# EAGLE schematic Rotall Encoder ver1.0 (EAGLE 9.6.2)
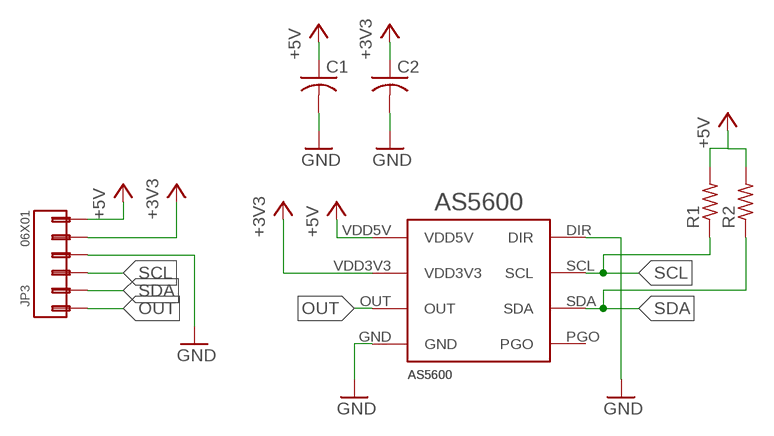
[diagram p0: schematic, sheet 1]

## Parts
C1  C-USC0603  [C0603]
C2  C-USC0603  [C0603]
JP3  06X01  [06X01]
R1  R-US_R0603  [R0603]
R2  R-US_R0603  [R0603]
U1  AS5600  [AS5600]

## Nets
+3V3: C2.1 JP3.2 U1.VDD3V3
+5V: C1.1 JP3.1 R1.2 R2.2 U1.VDD5V
GND: C1.2 C2.2 JP3.3 U1.DIR U1.GND
OUT: JP3.6 U1.OUT
SCL: JP3.4 R1.1 U1.SCL
SDA: JP3.5 R2.1 U1.SDA
Unconnected: U1.PGO

## Library data of the parts
C1 C2 = rcl:C-US: CAPACITOR, American symbol; SPICEPREFIX: C
JP3 = PinHeader:06X01
R1 R2 = rcl:R-US_: RESISTOR, American symbol; SPICEPREFIX: R
U1 = AS5600:AS5600